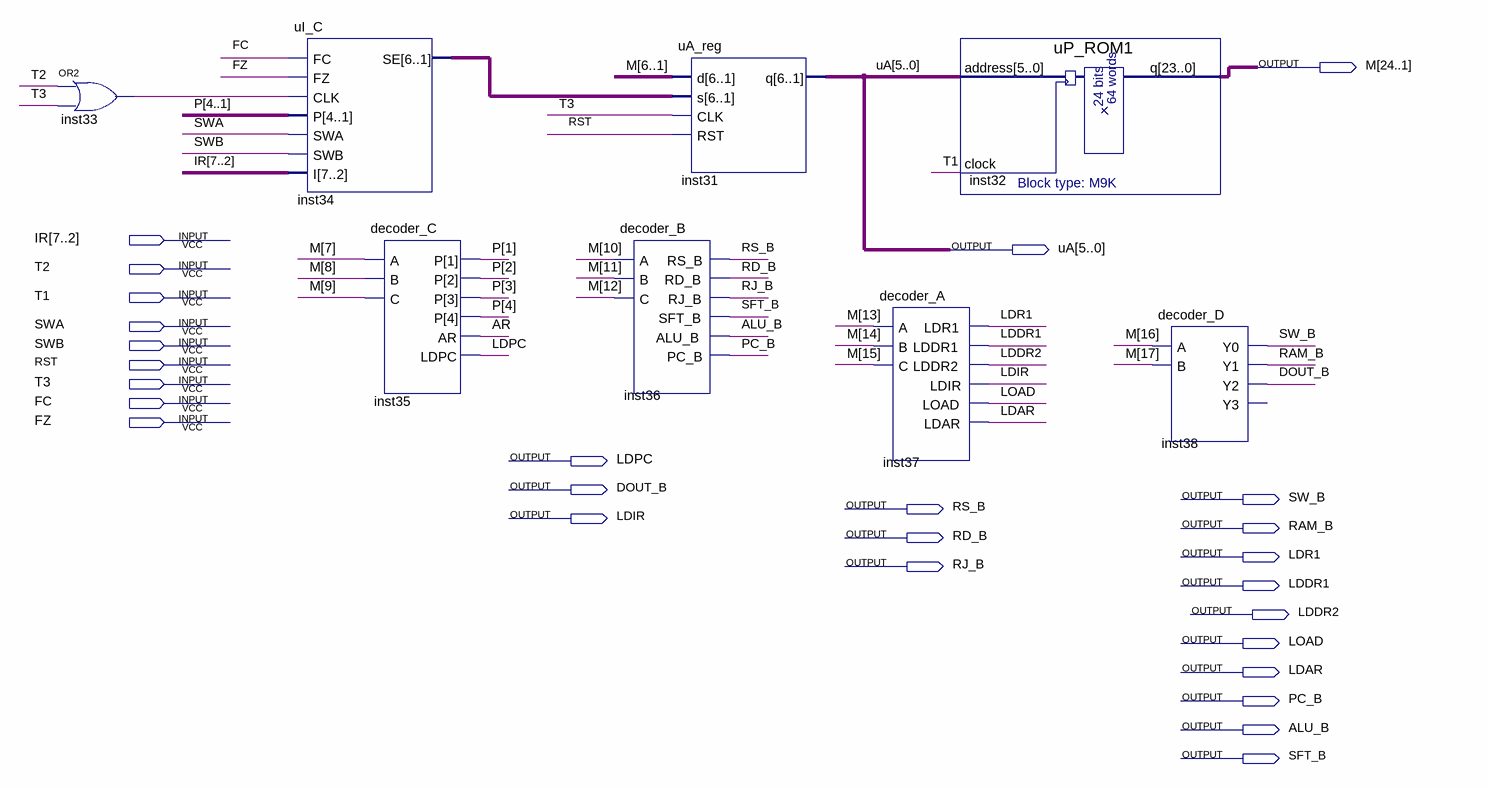
[diagram p0: schematic sheet]
// Quartus schematic uPC.bdf as structural Verilog: 8 symbols, 27 pins
module uPC (
  input  [7:2] IR,
  input  T2,
  input  T1,
  input  SWA,
  input  SWB,
  input  RST,
  input  T3,
  input  FC,
  input  FZ,
  output [24:1] M,
  output [5:0] uA,
  output LDPC,
  output DOUT_B,
  output SW_B,
  output RS_B,
  output LDIR,
  output RAM_B,
  output RD_B,
  output LDR1,
  output RJ_B,
  output LDDR1,
  output LDDR2,
  output LOAD,
  output LDAR,
  output PC_B,
  output ALU_B,
  output SFT_B
);

  wire AR, inst33_out;
  wire [4:1] P;
  wire [5:0] inst34_se;

  or inst33 (inst33_out, T2, T3);
  uI_C inst34 (.FC(FC), .FZ(FZ), .CLK(inst33_out), .P(P), .SWA(SWA), .SWB(SWB), .I(IR), .SE(inst34_se));
  decoder_C inst35 (.A(M[7]), .B(M[8]), .C(M[9]), .P(P), .AR(AR), .LDPC(LDPC));
  uA_reg inst31 (.d(M[6:1]), .s(inst34_se), .CLK(T3), .RST(RST), .q(uA));
  decoder_B inst36 (
    .A(M[10]), .B(M[11]), .C(M[12]), .RS_B(RS_B), .RD_B(RD_B), .RJ_B(RJ_B), .SFT_B(SFT_B), .ALU_B(ALU_B),
    .PC_B(PC_B));
  decoder_A inst37 (
    .A(M[13]), .B(M[14]), .C(M[15]), .LDR1(LDR1), .LDDR1(LDDR1), .LDDR2(LDDR2), .LDIR(LDIR), .LOAD(LOAD),
    .LDAR(LDAR));
  uP_ROM1 inst32 (.address(uA), .clock(T1), .q(M));
  decoder_D inst38 (.A(M[16]), .B(M[17]), .Y0(SW_B), .Y1(RAM_B), .Y2(DOUT_B));  // open: Y3
endmodule
